# EAGLE design Schaltplan_SMD (EAGLE 8.2.2)
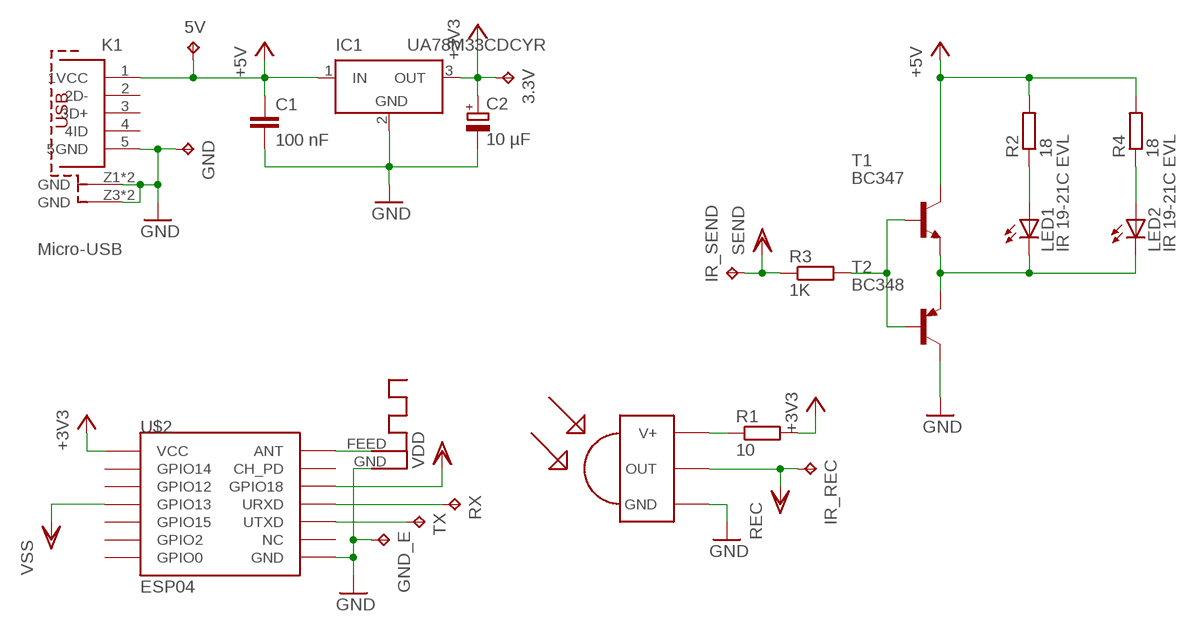
[diagram p0: schematic, sheet 1]

## Parts
3.3V  TPB2,54  [B2,54]
5V  TPB2,54  [B2,54]
ANT1  ANTENNA  [RN-ANT]
C1  100 nF  C-EUC0504  [C0504]
C2  10 µF  CPOL-EUUD-4X5,8  [UD-4X5,8_NICHICON]
GND  TPB2,54  [B2,54]
GND_E  TPB2,54  [B2,54]
IC1  UA78M33CDCYR  LT1129CST5  [SOT223]
IR-TRANSMITTER  TSOP1833  [TSOP18XX]
IR_REC  TPB2,54  [B2,54]
IR_SEND  TPB2,54  [B2,54]
K1  Micro-USB  629105150521  [629105150521]
LED1  IR 19-21C EVL  LEDCHIPLED_1206  [CHIPLED_1206]
LED2  IR 19-21C EVL  LEDCHIPLED_1206  [CHIPLED_1206]
R1  10  R-EU_R1206W  [R1206W]
R2  18  R-EU_R1206W  [R1206W]
R3  1K  R-EU_R1206W  [R1206W]
R4  18  R-EU_R1206W  [R1206W]
RX  TPB2,54  [B2,54]
T1  BC347  -NPN-SOT23-EBC  [SOT23-EBC]
T2  BC348  -PNP-SOT23-BCE  [SOT23-BCE]
TX  TPB2,54  [B2,54]
U$2  ESP04  [ESP04]

## Nets
+3V3: 3.3V.TP C2.+ IC1.3(OUT) R1.2 U$2.VCC
+5V: 5V.TP C1.1 IC1.1(IN) K1.1(1VCC) R2.2 R4.2 T1.C
GND: ANT1.GND C1.2 C2.- GND.TP GND_E.TP IC1.2(GND) IR-TRANSMITTER.GND K1.5(5GND) K1.Z1(GND) K1.Z2(GND) K1.Z3(GND) K1.Z4(GND) T2.C U$2.GND
N$1: IR-TRANSMITTER.VCC(V+) R1.1
N$2: R3.2 T1.B T2.B
N$3: ANT1.FEED U$2.ANT
N$4: RX.TP U$2.URXD
N$5: TX.TP U$2.UTXD
N$6: LED2.A R4.1
N$8: LED1.C LED2.C T1.E T2.E
N$10: LED1.A R2.1
SEND: IR_SEND.TP R3.1 U$2.GPIO18 ; supply symbol labelled VDD
VSS: IR-TRANSMITTER.OUT IR_REC.TP U$2.GPIO13 ; supply symbol labelled REC
Unconnected: K1.2(2D-) K1.3(3D+) K1.4(4ID) U$2.CH_PD U$2.GPIO0 U$2.GPIO2 U$2.GPIO12 U$2.GPIO14 U$2.GPIO15 U$2.NC

## Power pins joined to a net without a drawn wire
GND: IC1.4(GND)

## Library data of the parts
3.3V 5V GND GND_E IR_REC IR_SEND RX TX = testpad:TP: Test pad
ANT1 = adafruit:ANTENNA
C1 = rcl:C-EU: CAPACITOR, European symbol
C2 = rcl:CPOL-EU: POLARIZED CAPACITOR, European symbol
IC1 = linear-technology:LT1129CST5: VOLTAGE REGULATOR with shutdown; MPN: LT1129CST-5#PBF; OC_FARNELL: 1663375; OC_NEWARK: 57M2069
IR-TRANSMITTER = tsop:TSOP1833: IR Receiver and Demodulator
K1 = Wurth_Elektronik_Electromechanic_Input-Output_Connectors_rev15c:629105150521: WR-COM_USB_Micro Type B_Horizontal_SMT ; Micro Type B Horizontal SMT - 3A current at Pin1 & Pin 5 - with Pegs and THT shielding Pins - T&R Packaging Code : Con_I-O_COM_USB_2.0_B_629105150521_629105150521 <http://katalog.we-online.de/media/images/eican/Con_I-O_COM_USB_2.0_B_629105150521_pf2.jpg> Details see: http://katalog.we-online.de/em/datasheet/629105150521.pdf Created 12/08/2014, Dan Xu 2014 (C) Wurth Elektronik
LED1 LED2 = led:LED: LED OSRAM: - CHIPLED LG R971, LG N971, LY N971, LG Q971, LY Q971, LO R971, LY R971 LH N974, LH R974 LS Q976, LO Q976, LY Q976 LO Q996 - Hyper CHIPLED LW Q18S LB Q993, LB Q99A, LB R99A - SideLED LS A670, LO A670, LY A670, LG A670, LP A670 LB A673, LV A673, LT A673, LW A673 LH A674 LY A675 LS A676, LA A676, LO A676, LY A676, LW A676 LS A679, LY A679, LG A679 - Hyper Micro SIDELED® LS Y876, LA Y876, LO Y876, LY Y876 LT Y87S - SmartLED LW L88C, LW L88S LB L89C, LB L89S, LG L890 LS L89K, LO L89K, LY L89K LS L896, LA L896, LO L896, LY L896 - TOPLED LS T670, LO T670, LY T670, LG T670, LP T670 LSG T670, LSP T670, LSY T670, LOP T670, LYG T670 LG T671, LOG T671, LSG T671 LB T673, LV T673, LT T673, LW T673 LH T674 LS T676, LA T676, LO T676, LY T676, LB T676, LH T676, LSB T676, LW T676 LB T67C, LV T67C, LT T67C, LS T67K, LO T67K, LY T67K, LW E67C LS E67B, LA E67B, LO E67B, LY E67B, LB E67C, LV E67C, LT E67C LW T67C LS T679, LY T679, LG T679 LS T770, LO T770, LY T770, LG T770, LP T770 LB T773, LV T773, LT T773, LW T773 LH T774 LS E675, LA E675, LY E675, LS T675 LS T776, LA T776, LO T776, LY T776, LB T776 LHGB T686 LT T68C, LB T68C - Hyper Mini TOPLED® LB M676 - Mini TOPLED Santana® LG M470 LS M47K, LO M47K, LY M47K Source: http://www.osram.convergy.de LUXEON: - LUMILED® LXK2-PW12-R00, LXK2-PW12-S00, LXK2-PW14-U00, LXK2-PW14-V00 LXK2-PM12-R00, LXK2-PM12-S00, LXK2-PM14-U00 LXK2-PE12-Q00, LXK2-PE12-R00, LXK2-PE12-S00, LXK2-PE14-T00, LXK2-PE14-U00 LXK2-PB12-K00, LXK2-PB12-L00, LXK2-PB12-M00, LXK2-PB14-N00, LXK2-PB14-P00, LXK2-PB14-Q00 LXK2-PR12-L00, LXK2-PR12-M00, LXK2-PR14-Q00, LXK2-PR14-R00 LXK2-PD12-Q00, LXK2-PD12-R00, LXK2-PD12-S00 LXK2-PH12-R00, LXK2-PH12-S00 LXK2-PL12-P00, LXK2-PL12-Q00, LXK2-PL12-R00 Source: www.luxeon.com KINGBRIGHT: KA-3528ASYC Source: www.kingbright.com
R1-R4 = resistor:R-EU_: RESISTOR, European symbol
T1 = transistor-neu-to92:*-NPN-: NPN Transistror
T2 = transistor-neu-to92:*-PNP-: PNP Transistror
U$2 = esp8266modules:ESP04: ESP8266 Wifi module 04; DIMENSIONS: 14.7 x 12.1 mm; PINS: 14; PITCH: 0.078" / 2 mm

## Board
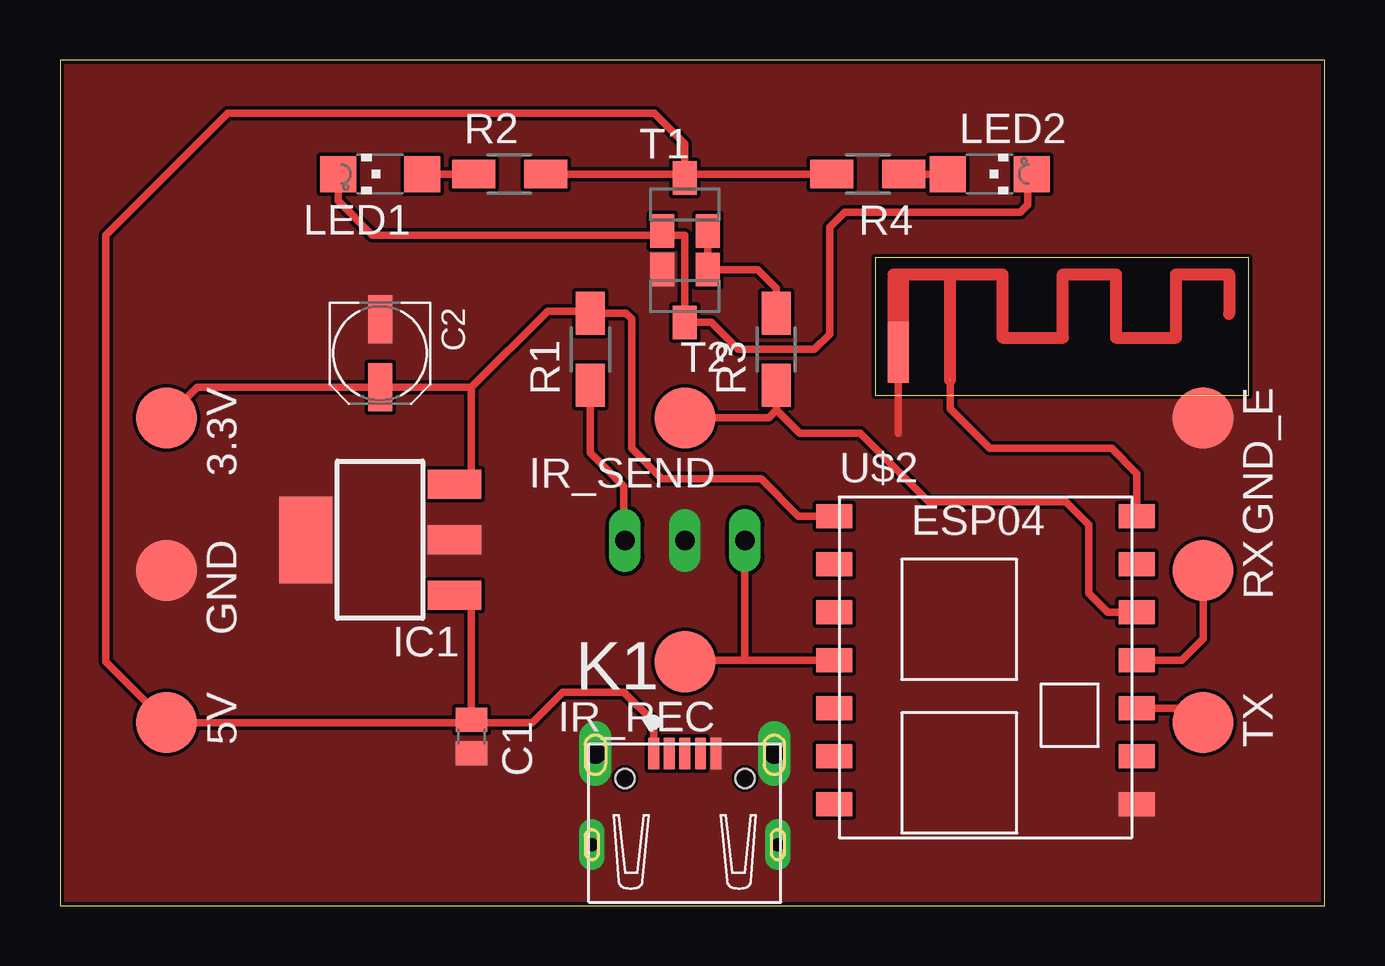
[diagram p1: board, top side]
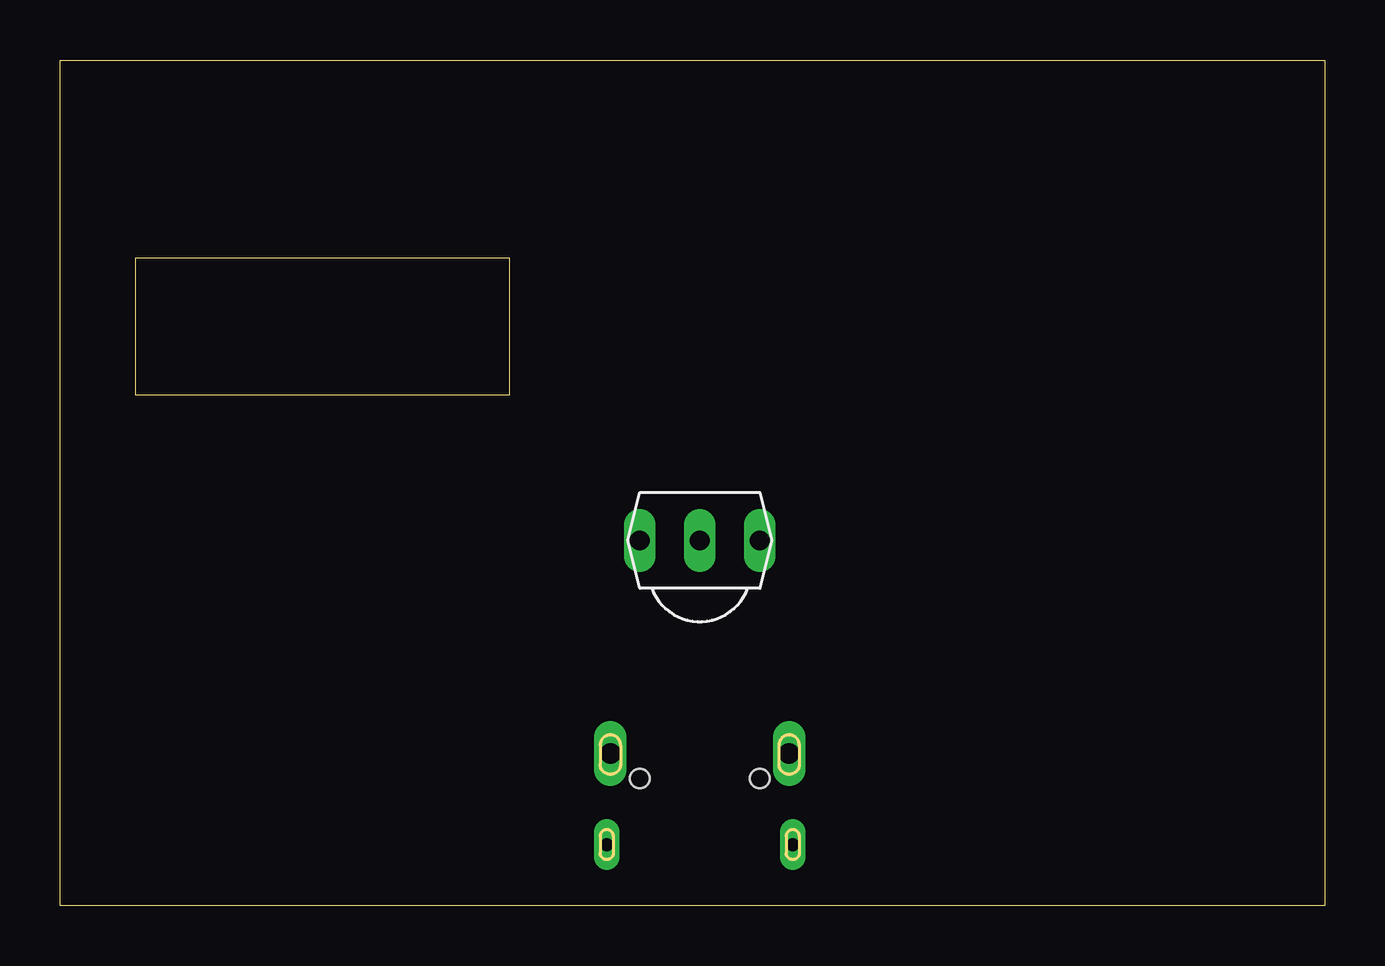
[diagram p2: board, bottom side, seen from below]

Size 52.69 x 35.23 mm. Coordinates in mm from the lower left corner, seen from the top.
Outline: 0,0 52.69,0 52.69,35.23 0,35.23 0,0
Copper layers (1*16): Top 0.035mm / dielectric 1.5mm / Bottom 0.035mm
Design rules "default *": minimum track width 6mil, minimum drill 0.35mm, track to track 6mil, track to pad 6mil, pad to pad 6mil, via to via 6mil, smd to smd 6mil, copper to edge 6mil, drill to drill 6mil, minimum pad ring 10mil, minimum via ring 8mil, stop-mask expansion 4mil, vias tented up to drill 0mil, thermal gap 10mil

### Footprints (pad centres in the part's own frame; a part is rotated, then mirrored left to right if it is on the bottom)
B2,54 = smd 2.54 x 2.54: TP 0,0
RN-ANT = smd 0.025 x 0.025: FEED 0,2.159 | smd 2.54 x 0.889: GND -1.143,0
C0504 = smd 1 x 1.3: 1 -0.7,0; 2 0.7,0
UD-4X5,8_NICHICON = smd 2 x 1: + 1.425,0; - -1.425,0
SOT223 = smd 1.219 x 2.235: 1 -2.311,-3.099; 2 0,-3.099; 3 2.311,-3.099 | smd 3.6 x 2.2: 4 0,3.099
TSOP18XX = drill 0.813 long: GND -0.001,-0.027; OUT -2.501,-0.027; VCC 2.499,-0.027
629105150521 = smd 0.45 x 1.3: 1 -1.3,3.8; 2 -0.65,3.8; 3 0,3.8; 4 0.65,3.8; 5 1.3,3.8 | drill 0.85 pad 1.2 long: Z1 -3.725,3.8; Z2 3.725,3.8 | drill 0.55 pad 0.9 long: Z3 3.875,0; Z4 -3.875,0 | hole 0.8: -2.5,2.75; 2.5,2.75
CHIPLED_1206 = smd 1.5 x 1.5: A 0,-1.75; C 0,1.75
R1206W = smd 1.8 x 1.2: 1 -1.499,0; 2 1.499,0
SOT23-EBC = smd 1 x 1.4: B 0.95,-1.1; C 0,1.1; E -0.95,-1.1
SOT23-BCE = smd 1 x 1.4: B -0.95,-1.1; C 0.95,-1.1; E 0,1.1
ESP04 = smd 1.5 x 1: ANT 12.48,7.34; CH_PD 12.48,5.34; GND 12.48,-4.66; GPIO0 -0.12,-4.66; GPIO2 -0.12,-2.66; GPIO12 -0.12,3.34; GPIO13 -0.12,1.34; GPIO14 -0.12,5.34; GPIO15 -0.12,-0.66; GPIO18 12.48,3.34; NC 12.48,-2.66; URXD 12.48,1.34; UTXD 12.48,-0.66; VCC -0.12,7.34

### Placement (x,y rotation side)
3.3V  4.45,20.32 270 top
5V  4.45,7.62 270 top
ANT1  34.92,21.91 270 top
C1  17.14,7.05 270 top
C2  13.34,23.02 270 top
GND  4.45,13.97 270 top
GND_E  47.62,20.32 270 top
IC1  13.34,15.24 90 top
IR-TRANSMITTER  26.04,15.24 0 bottom
IR_REC  26.04,10.16 180 top
IR_SEND  26.04,20.32 180 top
K1  26.04,2.54 0 top
LED1  13.34,30.48 90 top
LED2  38.73,30.48 270 top
R1  22.1,23.18 90 top
R2  18.73,30.48 0 top
R3  29.84,23.18 90 top
R4  33.66,30.48 180 top
RX  47.62,13.97 270 top
T1  26.04,29.21 0 top
T2  26.04,25.4 180 top
TX  47.62,7.62 270 top
U$2  32.38,8.89 0 top

### Tracks (layer width: path | path; a pad name or v marks a point on that pad's centre or on a via)
+3V3
  Top 0.305: 17.14,21.59 C2.+ 5.71,21.59 3.3V.TP | 17.14,21.59 20.32,24.77 22.01,24.77 R1.2 23.58,24.68 23.81,24.45 23.81,19.05 25.08,17.78 29.21,17.78 30.76,16.23 U$2.VCC | 17.14,21.59 17.14,17.46 16.52,17.46 IC1.3
+5V
  Top 0.305: R2.2 25.86,30.48 T1.C 26.15,30.43 | R4.2 26.2,30.48 26.15,30.43 | 17.02,7.62 5V.TP 1.91,10.16 1.91,27.94 6.99,33.02 24.77,33.02 26.04,31.75 26.04,30.54 26.15,30.43 | 17.02,7.62 C1.1 17.14,12.7 16.66,12.7 IC1.1 | K1.1 24.73,7.65 23.5,8.89 20.95,8.89 19.68,7.62 17.02,7.62
GND
  Top 0.305: ANT1.GND 34.92,19.68
  pour Top (no thermals): 0,35.24 0,0.32 0.32,0 52.7,0 52.7,35.24
N$1
  Top 0.305: R1.1 22.1,18.86 23.5,17.46 23.5,15.26 IR-TRANSMITTER.VCC
N$2
  Top 0.305: R3.2 29.84,25.72 29.06,26.5 T2.B T1.B
N$3
  Top 0.305: U$2.ANT 44.87,18 43.81,19.05 38.73,19.05 37.08,20.7 ANT1.FEED
N$4
  Top 0.305: U$2.URXD 46.74,10.23 47.62,11.11 RX.TP
N$5
  Top 0.305: U$2.UTXD 47.02,8.23 TX.TP
N$6
  Top 0.305: R4.1 LED2.A
N$8
  Top 0.305: LED2.C 40.32,30.32 40.32,29.21 40.01,28.89 32.7,28.89 32.07,28.26 32.07,23.81 31.43,23.18 28.26,23.18 27.14,24.3 T2.E 26.04,27.94 25.25,27.94 T1.E 24.91,27.94 13.02,27.94 11.59,29.37 LED1.C
N$10
  Top 0.305: LED1.A R2.1
SEND
  Top 0.305: IR_SEND.TP 29.53,20.32 29.84,20.64 29.84,20.66 | 29.84,20.66 R3.1 | U$2.GPIO18 43.65,12.23 42.86,13.02 42.86,15.88 41.91,16.83 36.2,16.83 33.34,19.68 30.82,19.68 29.84,20.66
VSS
  Top 0.305: 28.61,10.23 U$2.GPIO13 | 28.61,10.23 26.11,10.23 IR_REC.TP | IR-TRANSMITTER.OUT 28.54,10.31 28.61,10.23